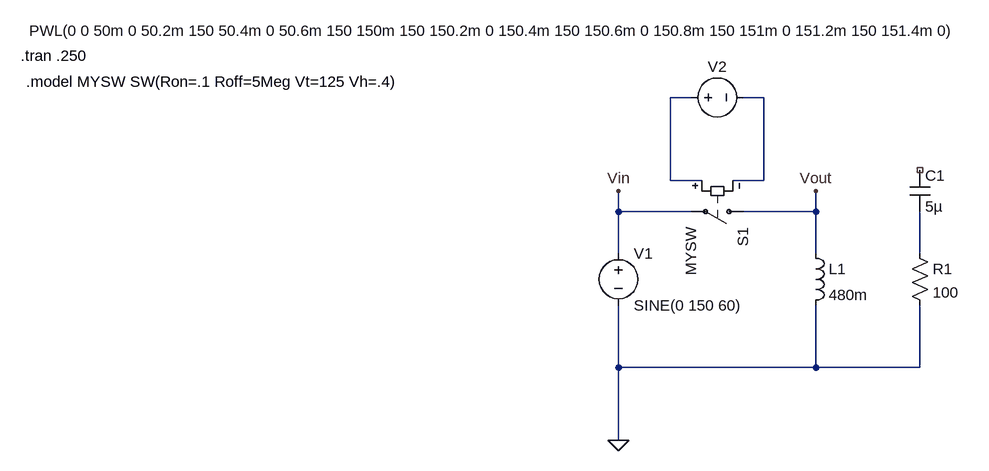
[diagram p0: schematic Contactarcing_test2.asc]
Contactarcing_test2.asc, the LTspice schematic file:
Version 4
SHEET 1 948 680
WIRE 128 -160 96 -160
WIRE 240 -160 208 -160
WIRE 96 -32 96 -160
WIRE 144 -32 96 -32
WIRE 240 -32 240 -160
WIRE 240 -32 192 -32
WIRE 16 16 16 -16
WIRE 128 16 16 16
WIRE 320 16 320 -16
WIRE 320 16 208 16
WIRE 16 80 16 16
WIRE 320 80 320 16
WIRE 480 80 480 16
WIRE 16 256 16 160
WIRE 320 256 320 160
WIRE 320 256 16 256
WIRE 480 256 480 160
WIRE 480 256 320 256
WIRE 16 368 16 256
FLAG 320 -16 Vout
FLAG 16 -16 Vin
FLAG 16 368 0
SYMBOL voltage 16 64 R0
WINDOW 123 0 0 Left 0
SYMATTR InstName V1
SYMATTR Value SINE(0 150 60)
SYMBOL ind 304 64 R0
SYMATTR InstName L1
SYMATTR Value 480m
SYMBOL res 464 64 R0
SYMATTR InstName R1
SYMATTR Value 100
SYMBOL cap 464 -48 R0
SYMATTR InstName C1
SYMATTR Value 5µ
SYMBOL sw 224 16 R90
SYMATTR InstName S1
SYMATTR Value MYSW
SYMBOL voltage 112 -160 R270
WINDOW 0 32 56 VTop 2
WINDOW 3 118 -280 VBottom 2
WINDOW 123 0 0 Left 0
WINDOW 39 0 0 Left 0
SYMATTR InstName V2
SYMATTR Value PWL(0 0 50m 0 50.2m 150 50.4m 0 50.6m 150 150m 150 150.2m 0 150.4m 150 150.6m 0 150.8m 150 151m 0 151.2m 150 151.4m 0)
TEXT -904 -224 Left 2 !.tran .250
TEXT -896 -184 Left 2 !.model MYSW SW(Ron=.1 Roff=5Meg Vt=125 Vh=.4)

The netlist it stands for:
* Contactarcing_test2.asc
V1 Vin 0 SINE(0 150 60)
L1 Vout 0 480m
R1 N003 0 100
C1 NC_01 N003 5µ
S1 Vout Vin N001 N002 MYSW
V2 N001 N002 PWL(0 0 50m 0 50.2m 150 50.4m 0 50.6m 150 150m 150 150.2m 0 150.4m 150 150.6m 0 150.8m 150 151m 0 151.2m 150 151.4m 0)
.tran .250
.model MYSW SW(Ron=.1 Roff=5Meg Vt=125 Vh=.4)
.backanno
.end